# EAGLE schematic bottom (EAGLE 5.10)
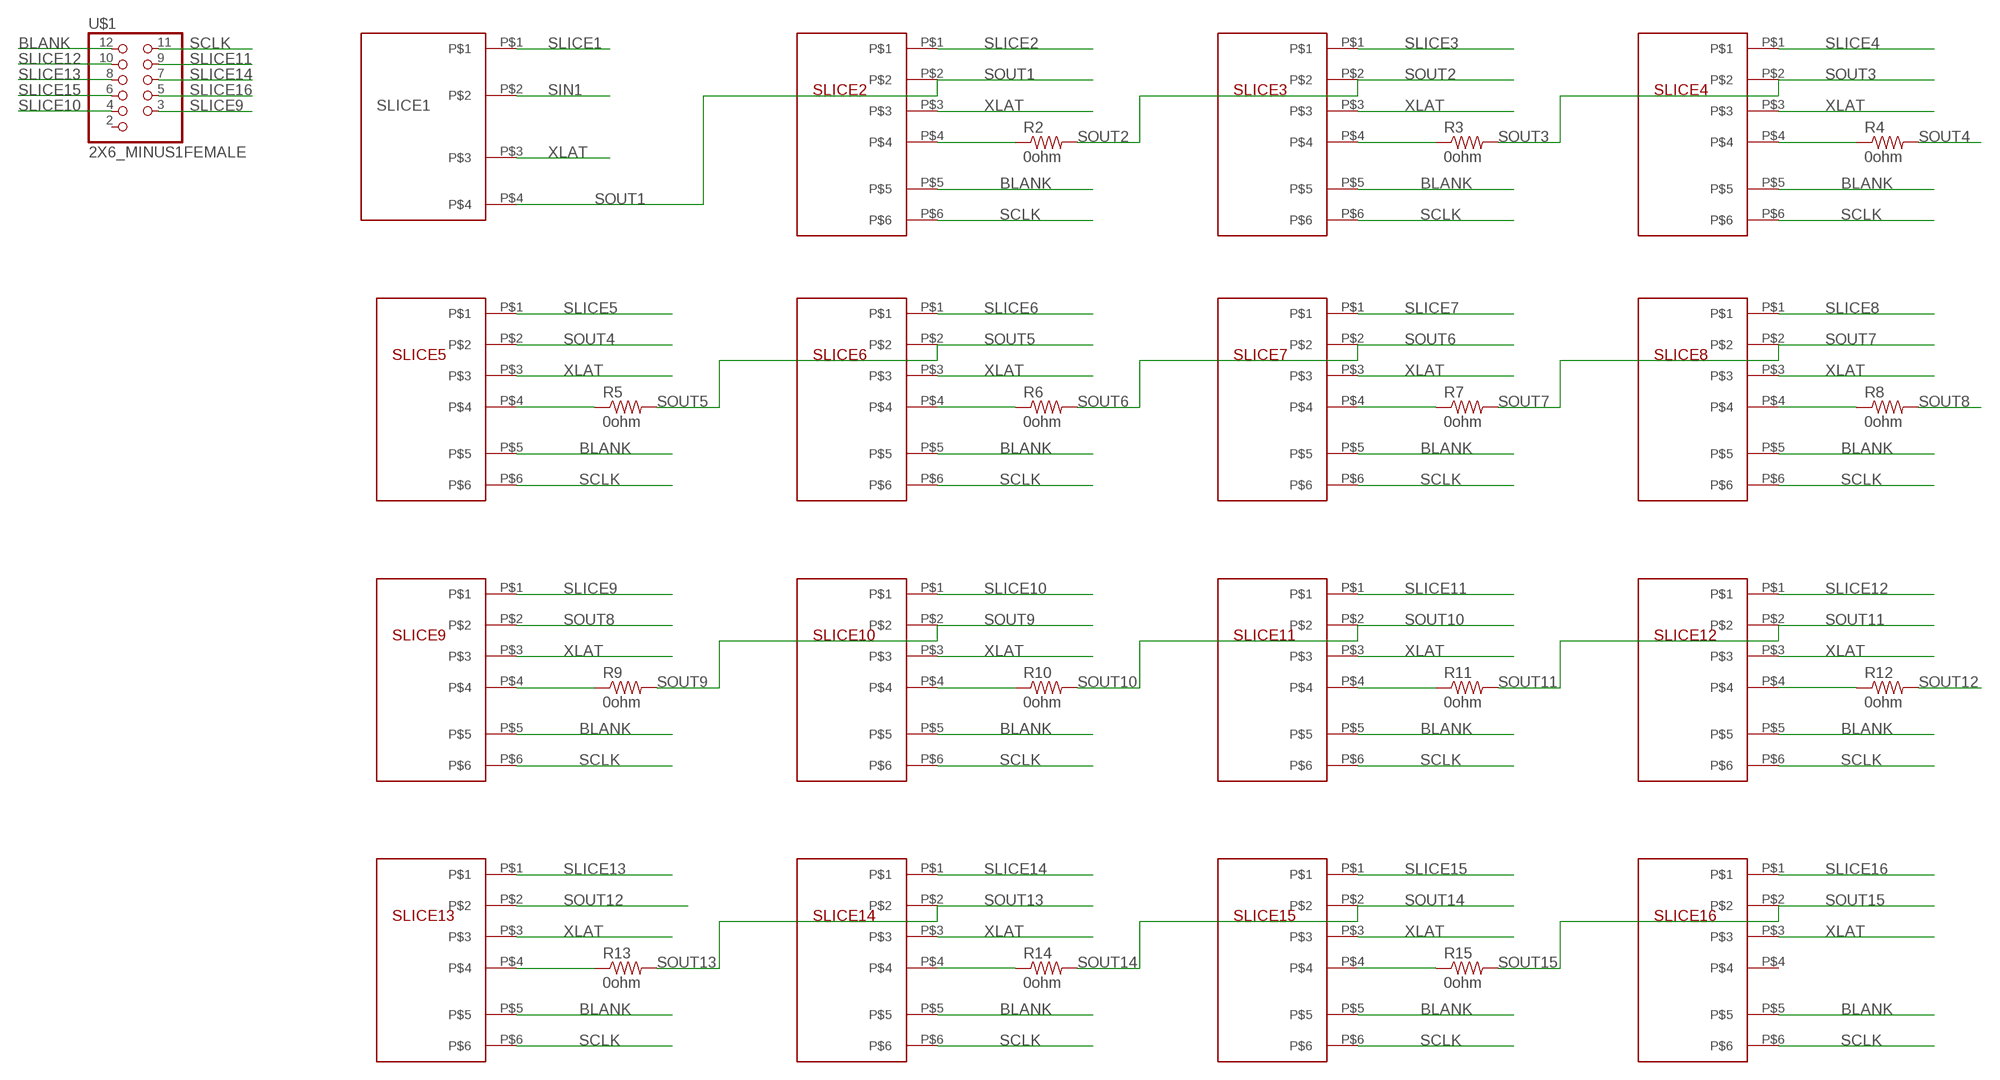
[diagram p0: schematic, sheet 1]

## Parts
R2  0ohm  R-US_R1206W  [R1206W]
R3  0ohm  R-US_R1206W  [R1206W]
R4  0ohm  R-US_R1206W  [R1206W]
R5  0ohm  R-US_R1206W  [R1206W]
R6  0ohm  R-US_R1206W  [R1206W]
R7  0ohm  R-US_R1206W  [R1206W]
R8  0ohm  R-US_R1206W  [R1206W]
R9  0ohm  R-US_R1206W  [R1206W]
R10  0ohm  R-US_R1206W  [R1206W]
R11  0ohm  R-US_R1206W  [R1206W]
R12  0ohm  R-US_R1206W  [R1206W]
R13  0ohm  R-US_R1206W  [R1206W]
R14  0ohm  R-US_R1206W  [R1206W]
R15  0ohm  R-US_R1206W  [R1206W]
SLICE1  SLICE_SOCKET  [SLICE_SOCKET]
SLICE2  SOCKET_W_1X2  [SLICE_SOCKET_W_1X2]
SLICE3  SOCKET_W_1X2  [SLICE_SOCKET_W_1X2]
SLICE4  SOCKET_W_1X2  [SLICE_SOCKET_W_1X2]
SLICE5  SOCKET_W_1X2  [SLICE_SOCKET_W_1X2]
SLICE6  SOCKET_W_1X2  [SLICE_SOCKET_W_1X2]
SLICE7  SOCKET_W_1X2  [SLICE_SOCKET_W_1X2]
SLICE8  SOCKET_W_1X2  [SLICE_SOCKET_W_1X2]
SLICE9  SOCKET_W_1X2  [SLICE_SOCKET_W_1X2]
SLICE10  SOCKET_W_1X2  [SLICE_SOCKET_W_1X2]
SLICE11  SOCKET_W_1X2  [SLICE_SOCKET_W_1X2]
SLICE12  SOCKET_W_1X2  [SLICE_SOCKET_W_1X2]
SLICE13  SOCKET_W_1X2  [SLICE_SOCKET_W_1X2]
SLICE14  SOCKET_W_1X2  [SLICE_SOCKET_W_1X2]
SLICE15  SOCKET_W_1X2  [SLICE_SOCKET_W_1X2]
SLICE16  SOCKET_W_1X2  [SLICE_SOCKET_W_1X2]
U$1  2X6_MINUS1FEMALE  [2X6_MINUS1_FM]

## Nets
BLANK: SLICE2.P$5 SLICE3.P$5 SLICE4.P$5 SLICE5.P$5 SLICE6.P$5 SLICE7.P$5 SLICE8.P$5 SLICE9.P$5 SLICE10.P$5 SLICE11.P$5 SLICE12.P$5 SLICE13.P$5 SLICE14.P$5 SLICE15.P$5 SLICE16.P$5 U$1.12
N$1: R2.1 SLICE2.P$4
N$2: R3.1 SLICE3.P$4
N$3: R4.1 SLICE4.P$4
N$4: R8.1 SLICE8.P$4
N$5: R7.1 SLICE7.P$4
N$6: R6.1 SLICE6.P$4
N$7: R5.1 SLICE5.P$4
N$8: R9.1 SLICE9.P$4
N$9: R10.1 SLICE10.P$4
N$10: R11.1 SLICE11.P$4
N$11: R12.1 SLICE12.P$4
N$13: R13.1 SLICE13.P$4
N$15: R15.1 SLICE15.P$4
N$16: R14.1 SLICE14.P$4
SCLK: SLICE2.P$6 SLICE3.P$6 SLICE4.P$6 SLICE5.P$6 SLICE6.P$6 SLICE7.P$6 SLICE8.P$6 SLICE9.P$6 SLICE10.P$6 SLICE11.P$6 SLICE12.P$6 SLICE13.P$6 SLICE14.P$6 SLICE15.P$6 SLICE16.P$6 U$1.11
SIN1: SLICE1.P$2
SLICE1: SLICE1.P$1
SLICE2: SLICE2.P$1
SLICE3: SLICE3.P$1
SLICE4: SLICE4.P$1
SLICE5: SLICE5.P$1
SLICE6: SLICE6.P$1
SLICE7: SLICE7.P$1
SLICE8: SLICE8.P$1
SLICE9: SLICE9.P$1 U$1.3
SLICE10: SLICE10.P$1 U$1.4
SLICE11: SLICE11.P$1 U$1.9
SLICE12: SLICE12.P$1 U$1.10
SLICE13: SLICE13.P$1 U$1.8
SLICE14: SLICE14.P$1 U$1.7
SLICE15: SLICE15.P$1 U$1.6
SLICE16: SLICE16.P$1 U$1.5
SOUT1: SLICE1.P$4 SLICE2.P$2
SOUT2: R2.2 SLICE3.P$2
SOUT3: R3.2 SLICE4.P$2
SOUT4: R4.2 SLICE5.P$2
SOUT5: R5.2 SLICE6.P$2
SOUT6: R6.2 SLICE7.P$2
SOUT7: R7.2 SLICE8.P$2
SOUT8: R8.2 SLICE9.P$2
SOUT9: R9.2 SLICE10.P$2
SOUT10: R10.2 SLICE11.P$2
SOUT11: R11.2 SLICE12.P$2
SOUT12: R12.2 SLICE13.P$2
SOUT13: R13.2 SLICE14.P$2
SOUT14: R14.2 SLICE15.P$2
SOUT15: R15.2 SLICE16.P$2
XLAT: SLICE1.P$3 SLICE2.P$3 SLICE3.P$3 SLICE4.P$3 SLICE5.P$3 SLICE6.P$3 SLICE7.P$3 SLICE8.P$3 SLICE9.P$3 SLICE10.P$3 SLICE11.P$3 SLICE12.P$3 SLICE13.P$3 SLICE14.P$3 SLICE15.P$3 SLICE16.P$3
Unconnected: SLICE16.P$4 U$1.2

## Library data of the parts
R2-R15 = resistor:R-US_: RESISTOR, American symbol
SLICE1 = slice:SLICE_SOCKET
SLICE2-SLICE16 = bottom:SOCKET_W_1X2
U$1 = slice:2X6_MINUS1